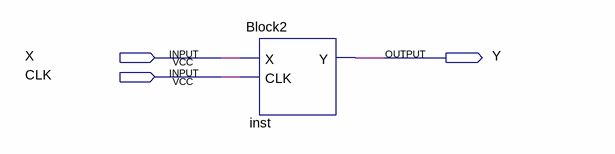
[diagram p0: schematic sheet]
// Quartus schematic Block3.bdf as structural Verilog: 1 symbols, 3 pins
module Block3 (
  input  X,
  input  CLK,
  output Y
);

  Block2 inst (.X(X), .CLK(CLK), .Y(Y));
endmodule
